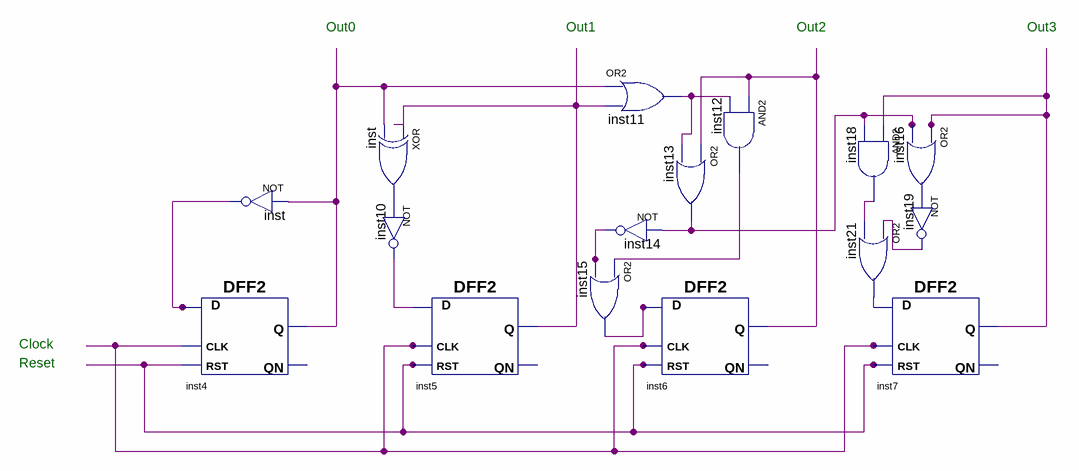
[diagram p0: schematic sheet]
// Quartus schematic DownCounterSchematic.bdf as structural Verilog: 16 symbols, 0 pins
module DownCounterSchematic (
);

  wire inst4_q, inst5_q, inst6_q, inst7_q, inst10_out, inst11_out, inst12_out, inst13_out, inst14_out,
       inst15_out, inst18_out, inst19_out, inst21_out, inst_out, inst_out_2, undriven, undriven_2;

  DFF2 inst4 (.CLK(undriven_2), .D(inst_out), .RST(undriven), .Q(inst4_q));  // open: QN
  not inst (inst_out, inst4_q);
  xor inst_dup2 (inst_out_2, inst5_q, inst4_q);
  not inst10 (inst10_out, inst_out_2);
  DFF2 inst5 (.CLK(undriven_2), .D(inst10_out), .RST(undriven), .Q(inst5_q));  // open: QN
  or inst15 (inst15_out, inst12_out, inst14_out);
  or inst11 (inst11_out, inst4_q, inst5_q);
  or inst13 (inst13_out, inst6_q, inst11_out);
  not inst14 (inst14_out, inst13_out);
  DFF2 inst6 (.CLK(undriven_2), .D(inst15_out), .RST(undriven), .Q(inst6_q));  // open: QN
  and inst12 (inst12_out, inst6_q, inst11_out);
  // OR2 inst16 has open pins: IN1=inst7_q, IN2=inst13_out, OUT=open
  and inst18 (inst18_out, inst7_q, inst13_out);
  or inst21 (inst21_out, inst19_out, inst18_out);
  DFF2 inst7 (.CLK(undriven_2), .D(inst21_out), .RST(undriven), .Q(inst7_q));  // open: QN
  // NOT inst19 has open pins: IN=open, OUT=inst19_out

  // Notes on the sheet:
  //   Out0
  //   Out1
  //   Out2
  //   Out3
  //   Clock
  //   Reset
endmodule
